# Altium schematic sheet k210_V3.0.SchDoc
size A3
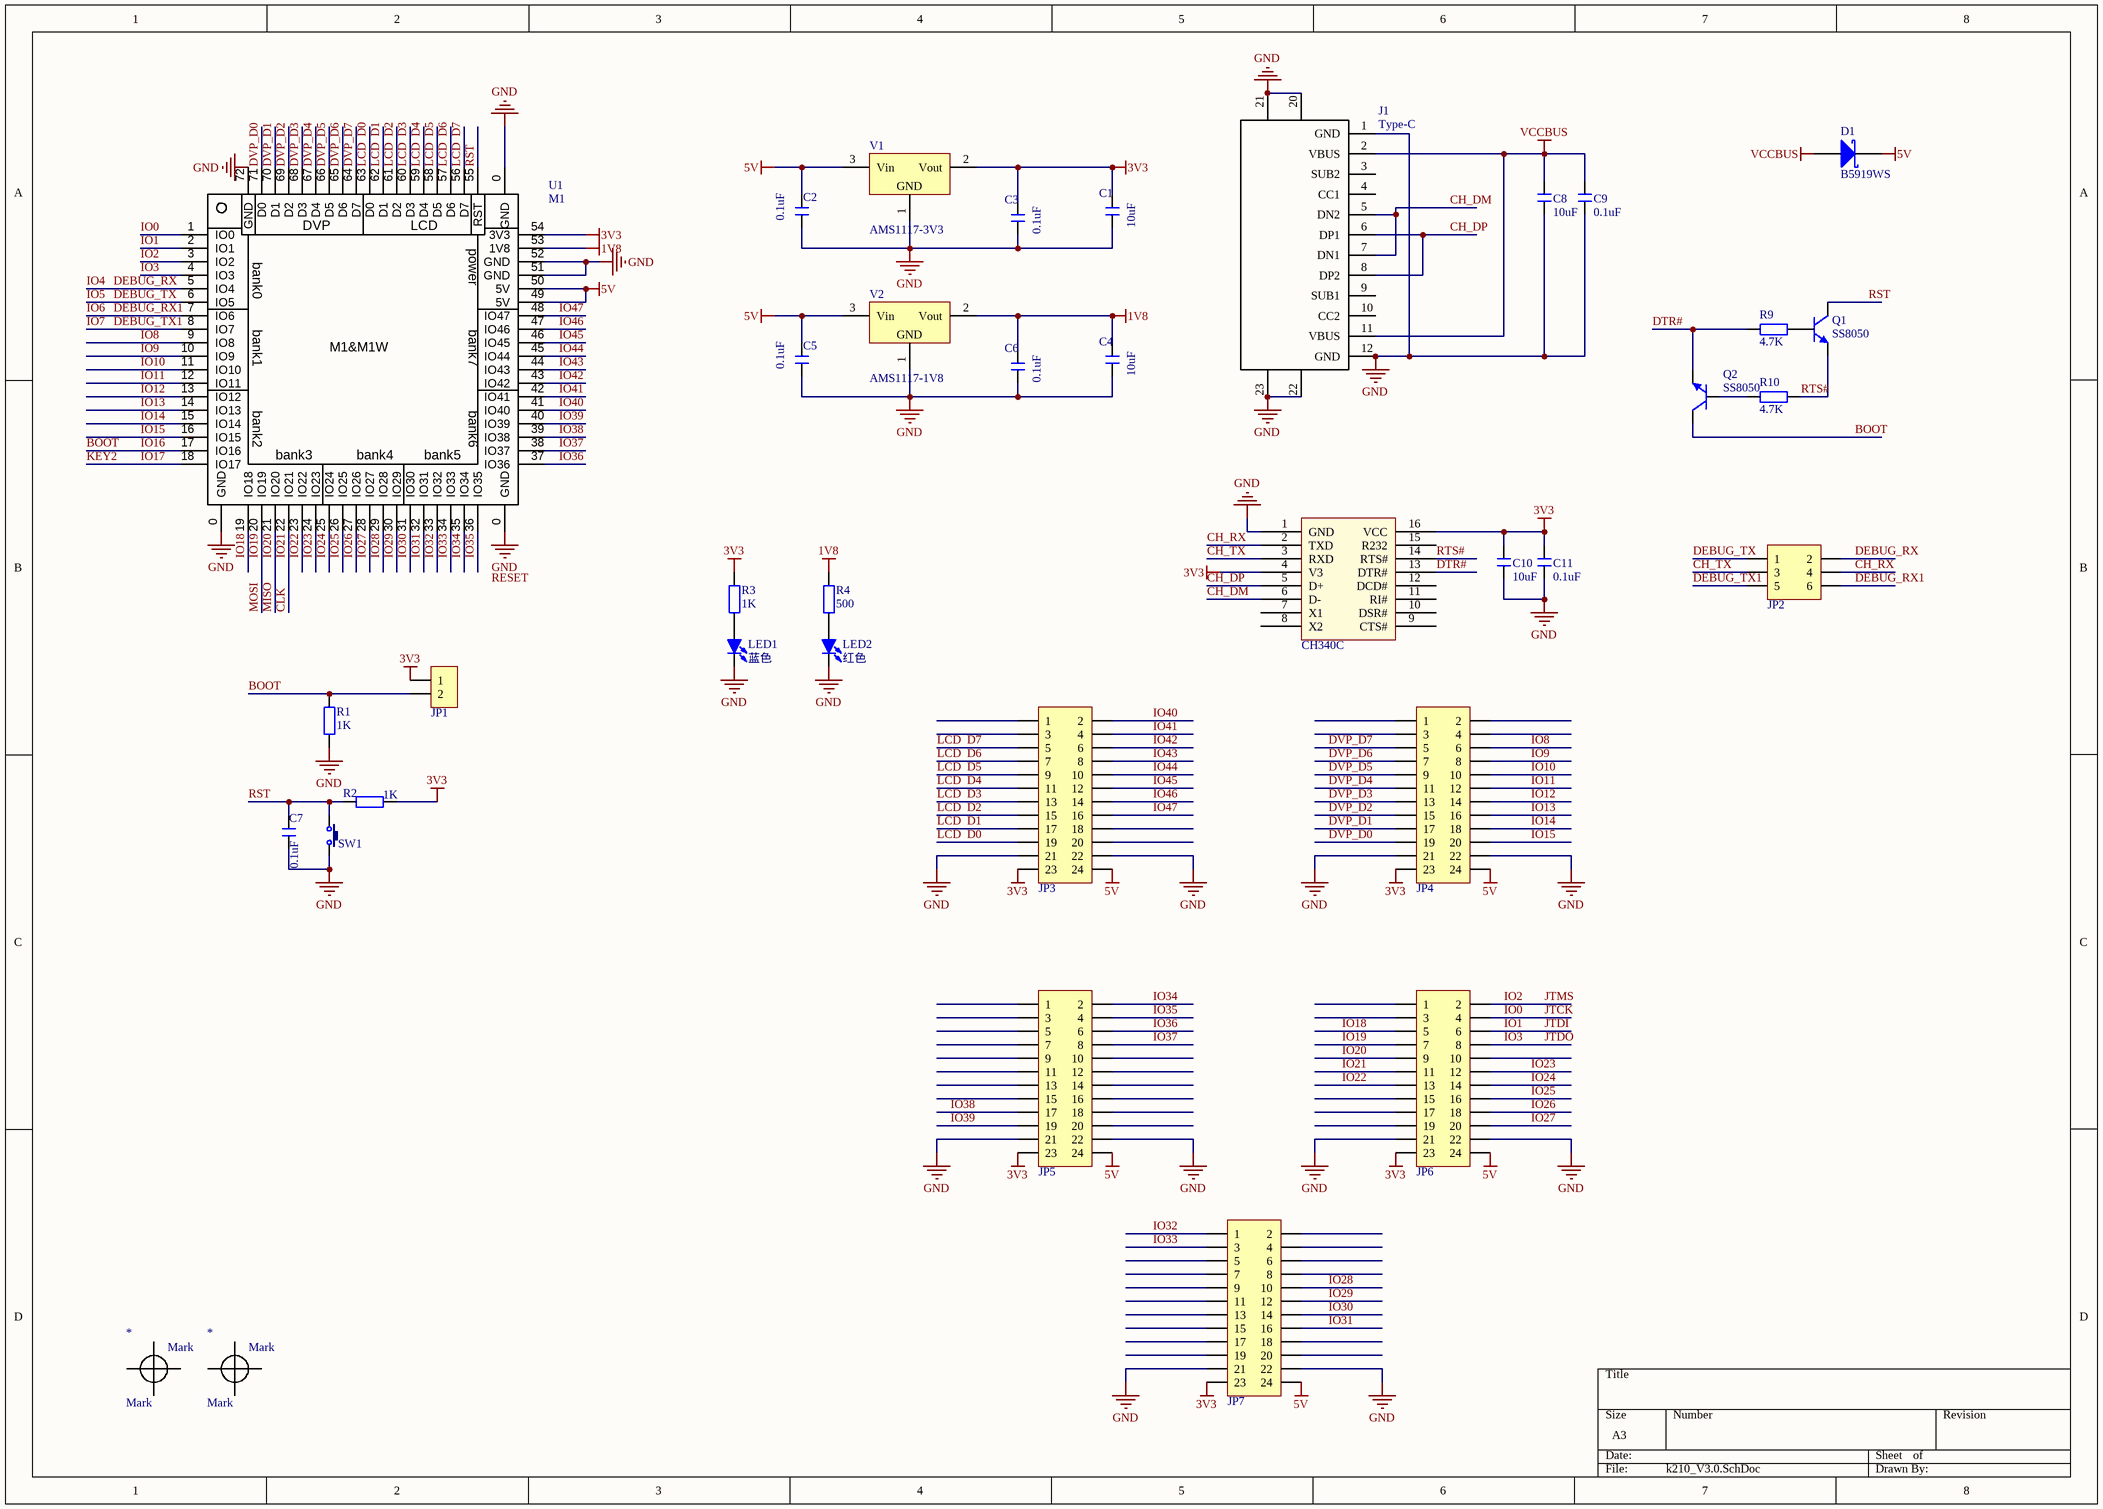
[diagram p0: k210_V3.0.SchDoc]

## Parts
(Parts that share a designator on the sheet are numbered #1, #2 ... from top to bottom, then left to right.)
*#1  Mark  [Mark]  (no BOM)
*#2  Mark  [Mark]  (no BOM)
C1  10uF  [C 0603_L]
C2  0.1uF  [C 0603_L]
C3  0.1uF  [C 0603_L]
C4  10uF  [C 0603_L]
C5  0.1uF  [C 0603_L]
C6  0.1uF  [C 0603_L]
C7  0.1uF  [C 0603_L]
C8  10uF  [C 0603_L]
C9  0.1uF  [C 0603_L]
C10  10uF  [C 0603_L]
C11  0.1uF  [C 0603_L]
CH340C  CH340G  [sop16_L]  (value not drawn)
D1  B5919WS  [SOD-323]
J1  Type-C  [Type-C-16]
JP1  HDR-1X2  [HDR2.54-M-LI-2P]  (value not drawn)
JP2  Header3X2  [HDR2.54-LI-2x3P]  (value not drawn)
JP3  Header 2X11  [HDR2.54-WI-2x12P]  (value not drawn)
JP4  Header 2X11  [HDR2.54-WI-2x12P]  (value not drawn)
JP5  Header 2X11  [HDR2.54-WI-2x12P]  (value not drawn)
JP6  Header 2X11  [HDR2.54-WI-2x12P]  (value not drawn)
JP7  Header 2X11  [HDR2.54-WI-2x12P]  (value not drawn)
LED1  蓝色  [LED 0603R]
LED2  红色  [LED 0603R]
Q1  SS8050  [SOT23-3N]
Q2  SS8050  [SOT23-3N]
R1  1K  [R 0603_L]
R2  1K  [R 0603_L]
R3  1K  [R 0603_L]
R4  500  [R 0603_L]
R9  4.7K  [R 0603_L]
R10  4.7K  [R 0603_L]
SW1  3x6x5  [TSW SMD-3*6*2.5]  (value not drawn)
U1  M1  [M1]
V1  AMS1117-3V3  [SOT223_L]
V2  AMS1117-1V8  [SOT223_L]

## Nets
1V8: C4.2 C6.2 R4.2 U1.53(1V8) V2.2(Vout)
3V3: C1.2 C3.2 C10.2 C11.2 CH340C.4(V3) CH340C.16(VCC) JP1.1 JP3.23 JP4.23 JP5.23 JP6.23 JP7.23 R2.1 R3.2 U1.54(3V3) V1.2(Vout)
5V: C2.2 C5.2 D1.2(K) JP3.24 JP4.24 JP5.24 JP6.24 JP7.24 U1.49(5V) U1.50(5V) V1.3(Vin) V2.3(Vin)
GND: C1.1 C2.1 C3.1 C4.1 C5.1 C6.1 C7.1 C8.1 C9.1 C10.1 C11.1 CH340C.1(GND) J1.1(GND) J1.12(GND) J1.20 J1.21 J1.22 J1.23 JP3.21 JP3.22 JP4.21 JP4.22 JP5.21 JP5.22 JP6.21 JP6.22 JP7.21 JP7.22 LED1.2(K) LED2.2(K) R1.2 SW1.2 U1.0(GND) U1.51(GND) U1.52(GND) U1.72(GND) V1.1(GND) V2.1(GND)
VCCBUS: C8.2 C9.2 D1.1(A) J1.2(VBUS) J1.11(VBUS)
BOOT: JP1.2 Q2.3(C) R1.1 U1.17(IO16)  [also labelled IO16]
CH_DM: CH340C.6(D-) J1.5(DN2) J1.7(DN1)
CH_DP: CH340C.5(D+) J1.6(DP1) J1.8(DP2)
CH_RX: CH340C.2(TXD) JP2.4
CH_TX: CH340C.3(RXD) JP2.3
CLK: JP6.11 U1.22(IO21)  [also labelled IO21]
DEBUG_RX: JP2.2 U1.5(IO4)  [also labelled IO4]
DEBUG_RX1: JP2.6 U1.7(IO6)  [also labelled IO6]
DEBUG_TX: JP2.1 U1.6(IO5)  [also labelled IO5]
DEBUG_TX1: JP2.5 U1.8(IO7)  [also labelled IO7]
DTR#: CH340C.13(DTR#) Q2.2(E) R9.1
DVP_D0: JP4.19 U1.71(D0)
DVP_D1: JP4.17 U1.70(D1)
DVP_D2: JP4.15 U1.69(D2)
DVP_D3: JP4.13 U1.68(D3)
DVP_D4: JP4.11 U1.67(D4)
DVP_D5: JP4.9 U1.66(D5)
DVP_D6: JP4.7 U1.65(D6)
DVP_D7: JP4.5 U1.64(D7)
IO0: JP6.4 U1.1(IO0)  [also labelled JTCK]
IO1: JP6.6 U1.2(IO1)  [also labelled JTDI]
IO2: JP6.2 U1.3(IO2)  [also labelled JTMS]
IO3: JP6.8 U1.4(IO3)  [also labelled JTDO]
IO8: JP4.6 U1.9(IO8)
IO9: JP4.8 U1.10(IO9)
IO10: JP4.10 U1.11(IO10)
IO11: JP4.12 U1.12(IO11)
IO12: JP4.14 U1.13(IO12)
IO13: JP4.16 U1.14(IO13)
IO14: JP4.18 U1.15(IO14)
IO15: JP4.20 U1.16(IO15)
IO17: U1.18(IO17)  [also labelled KEY2]
IO18: JP6.5 U1.19(IO18)
IO19: JP6.7 U1.20(IO19)  [also labelled MOSI]
IO20: JP6.9 U1.21(IO20)  [also labelled MISO]
IO22: JP6.13 U1.23(IO22)
IO23: JP6.12 U1.24(IO23)
IO24: JP6.14 U1.25(IO24)
IO25: JP6.16 U1.26(IO25)
IO26: JP6.18 U1.27(IO26)
IO27: JP6.20 U1.28(IO27)
IO28: JP7.10 U1.29(IO28)
IO29: JP7.12 U1.30(IO29)
IO30: JP7.14 U1.31(IO30)
IO31: JP7.16 U1.32(IO31)
IO32: JP7.1 U1.33(IO32)
IO33: JP7.3 U1.34(IO33)
IO34: JP5.2 U1.35(IO34)
IO35: JP5.4 U1.36(IO35)
IO36: JP5.6 U1.37(IO36)
IO37: JP5.8 U1.38(IO37)
IO38: JP5.17 U1.39(IO38)
IO39: JP5.19 U1.40(IO39)
IO40: JP3.2 U1.41(IO40)
IO41: JP3.4 U1.42(IO41)
IO42: JP3.6 U1.43(IO42)
IO43: JP3.8 U1.44(IO43)
IO44: JP3.10 U1.45(IO44)
IO45: JP3.12 U1.46(IO45)
IO46: JP3.14 U1.47(IO46)
IO47: JP3.16 U1.48(IO47)
LCD  D0: JP3.19 U1.63(D0)
LCD  D1: JP3.17 U1.62(D1)
LCD  D2: JP3.15 U1.61(D2)
LCD  D3: JP3.13 U1.60(D3)
LCD  D4: JP3.11 U1.59(D4)
LCD  D5: JP3.9 U1.58(D5)
LCD  D6: JP3.7 U1.57(D6)
LCD  D7: JP3.5 U1.56(D7)
RST: C7.2 Q1.3(C) R2.2 SW1.1 U1.55(RST)
RTS#: CH340C.14(RTS#) Q1.2(E) R10.2
NetLED1_1: LED1.1(A) R3.1
NetLED2_1: LED2.1(A) R4.1
NetQ1_1: Q1.1(B) R9.2
NetQ2_1: Q2.1(B) R10.1

Not connected (* = marked no-connect by the designer): CH340C 7(X1) 8(X2) 9(CTS#) 10(DSR#) 11(RI#) 12(DCD#) 15(R232); J1 3(SUB2) 4(CC1) 9(SUB1) 10(CC2); JP3 1 3 18 20; JP4 1 2 3 4; JP5 1 3 5 7 9 10 11 12 13 14 15 16 18 20; JP6 1 3 10 15 17 19; JP7 2 4 5 6 7 8 9 11 13 15 17 18 19 20

## Notes on the sheet
- Labels drawn without touching a wire or pin: RESET
- (in symbol M1) DVP; LCD; power; bank0; bank1; bank7; M1&M1W; bank2; bank6; bank3; bank4; bank5

## Library data of the parts
C1-C7 = C: 贴片电容
C8-C11 = C: 贴片电容; BOM名称: 无极性贴片电容; 淘宝ID: 封装库来自淘宝 ID：黄晶宝石; 联系售后，技术支持: https://shop463601444.taobao.com; 唯一出售店铺网址: https://shop463601444.taobao.com
CH340C = CH340G: 技术支持，联系售后: 封装库来自淘宝卖家 ID：黄晶宝石; 唯一出售店铺网址: https://shop463601444.taobao.com
D1 = 1N5819: 肖特基二极管; 淘宝ID: 封装库来自淘宝 ID：黄晶宝石; 属性: 40V/2A; BOM名称: 肖特基二极管; 欢迎光临: https://shop463601444.taobao.com
JP1 = Header 2: 2P接插件; 版权归属: 封装库来自淘宝 ID：黄晶宝石; BOM名称: 2P接插件; 联系售后: https://shop463601444.taobao.com
JP2 = Header 3X2: 3*2P接插件; 版权归属: 封装库来自淘宝 ID：黄晶宝石; BOM名称: 3*2P接插件; 学习资源: https://shop463601444.taobao.com
JP3-JP7 = Header 12X2: 12*2P接插件; 版权归属: 封装库来自淘宝卖家 ID：黄晶宝石; BOM名称: 12*2P接插件; 学习资源: https://shop463601444.taobao.com
LED1 LED2 = LED-SMD: 贴片LED; 版权归属: 封装库来自淘宝 ID：黄晶宝石; BOM名称: 贴片LED; 学习资源: https://shop463601444.taobao.com
Q1 Q2 = 8050-SMD: 高频放大-NPN型; 版权归属: 封装库来自淘宝 ID：黄晶宝石; 属性: 40V 1.5A 1W 100MHZ; BOM名称: 高频放大-NPN型; 联系售后: https://shop463601444.taobao.com
R1 R2 = R: 贴片电阻
R3 R4 R9 R10 = R: 贴片电阻; 版权归属: 来自淘宝 ID：黄晶宝石; 封装库来自淘宝卖家 ID：黄晶宝石: 其他店铺购入均为盗版，不享受售后技术支持服务，请立即申请退款; BOM名称: 贴片电阻; 联系售后: https://shop463601444.taobao.com
SW1 = TSW 3x6: 3x6轻触开关; 版权归属: 封装库来自淘宝 ID：黄晶宝石; BOM名称: 3x6轻触开关; 学习资源: https://shop463601444.taobao.com
V1 V2 = AMS1117: 三端稳压芯片; BOM名称: 稳压芯片; 淘宝ID: 封装库来自淘宝 ID：黄晶宝石; 欢迎光临淘宝店铺: https://shop463601444.taobao.com